# EAGLE design Wedding_Centerpiece_Controller_V1.1 (EAGLE 6.4)
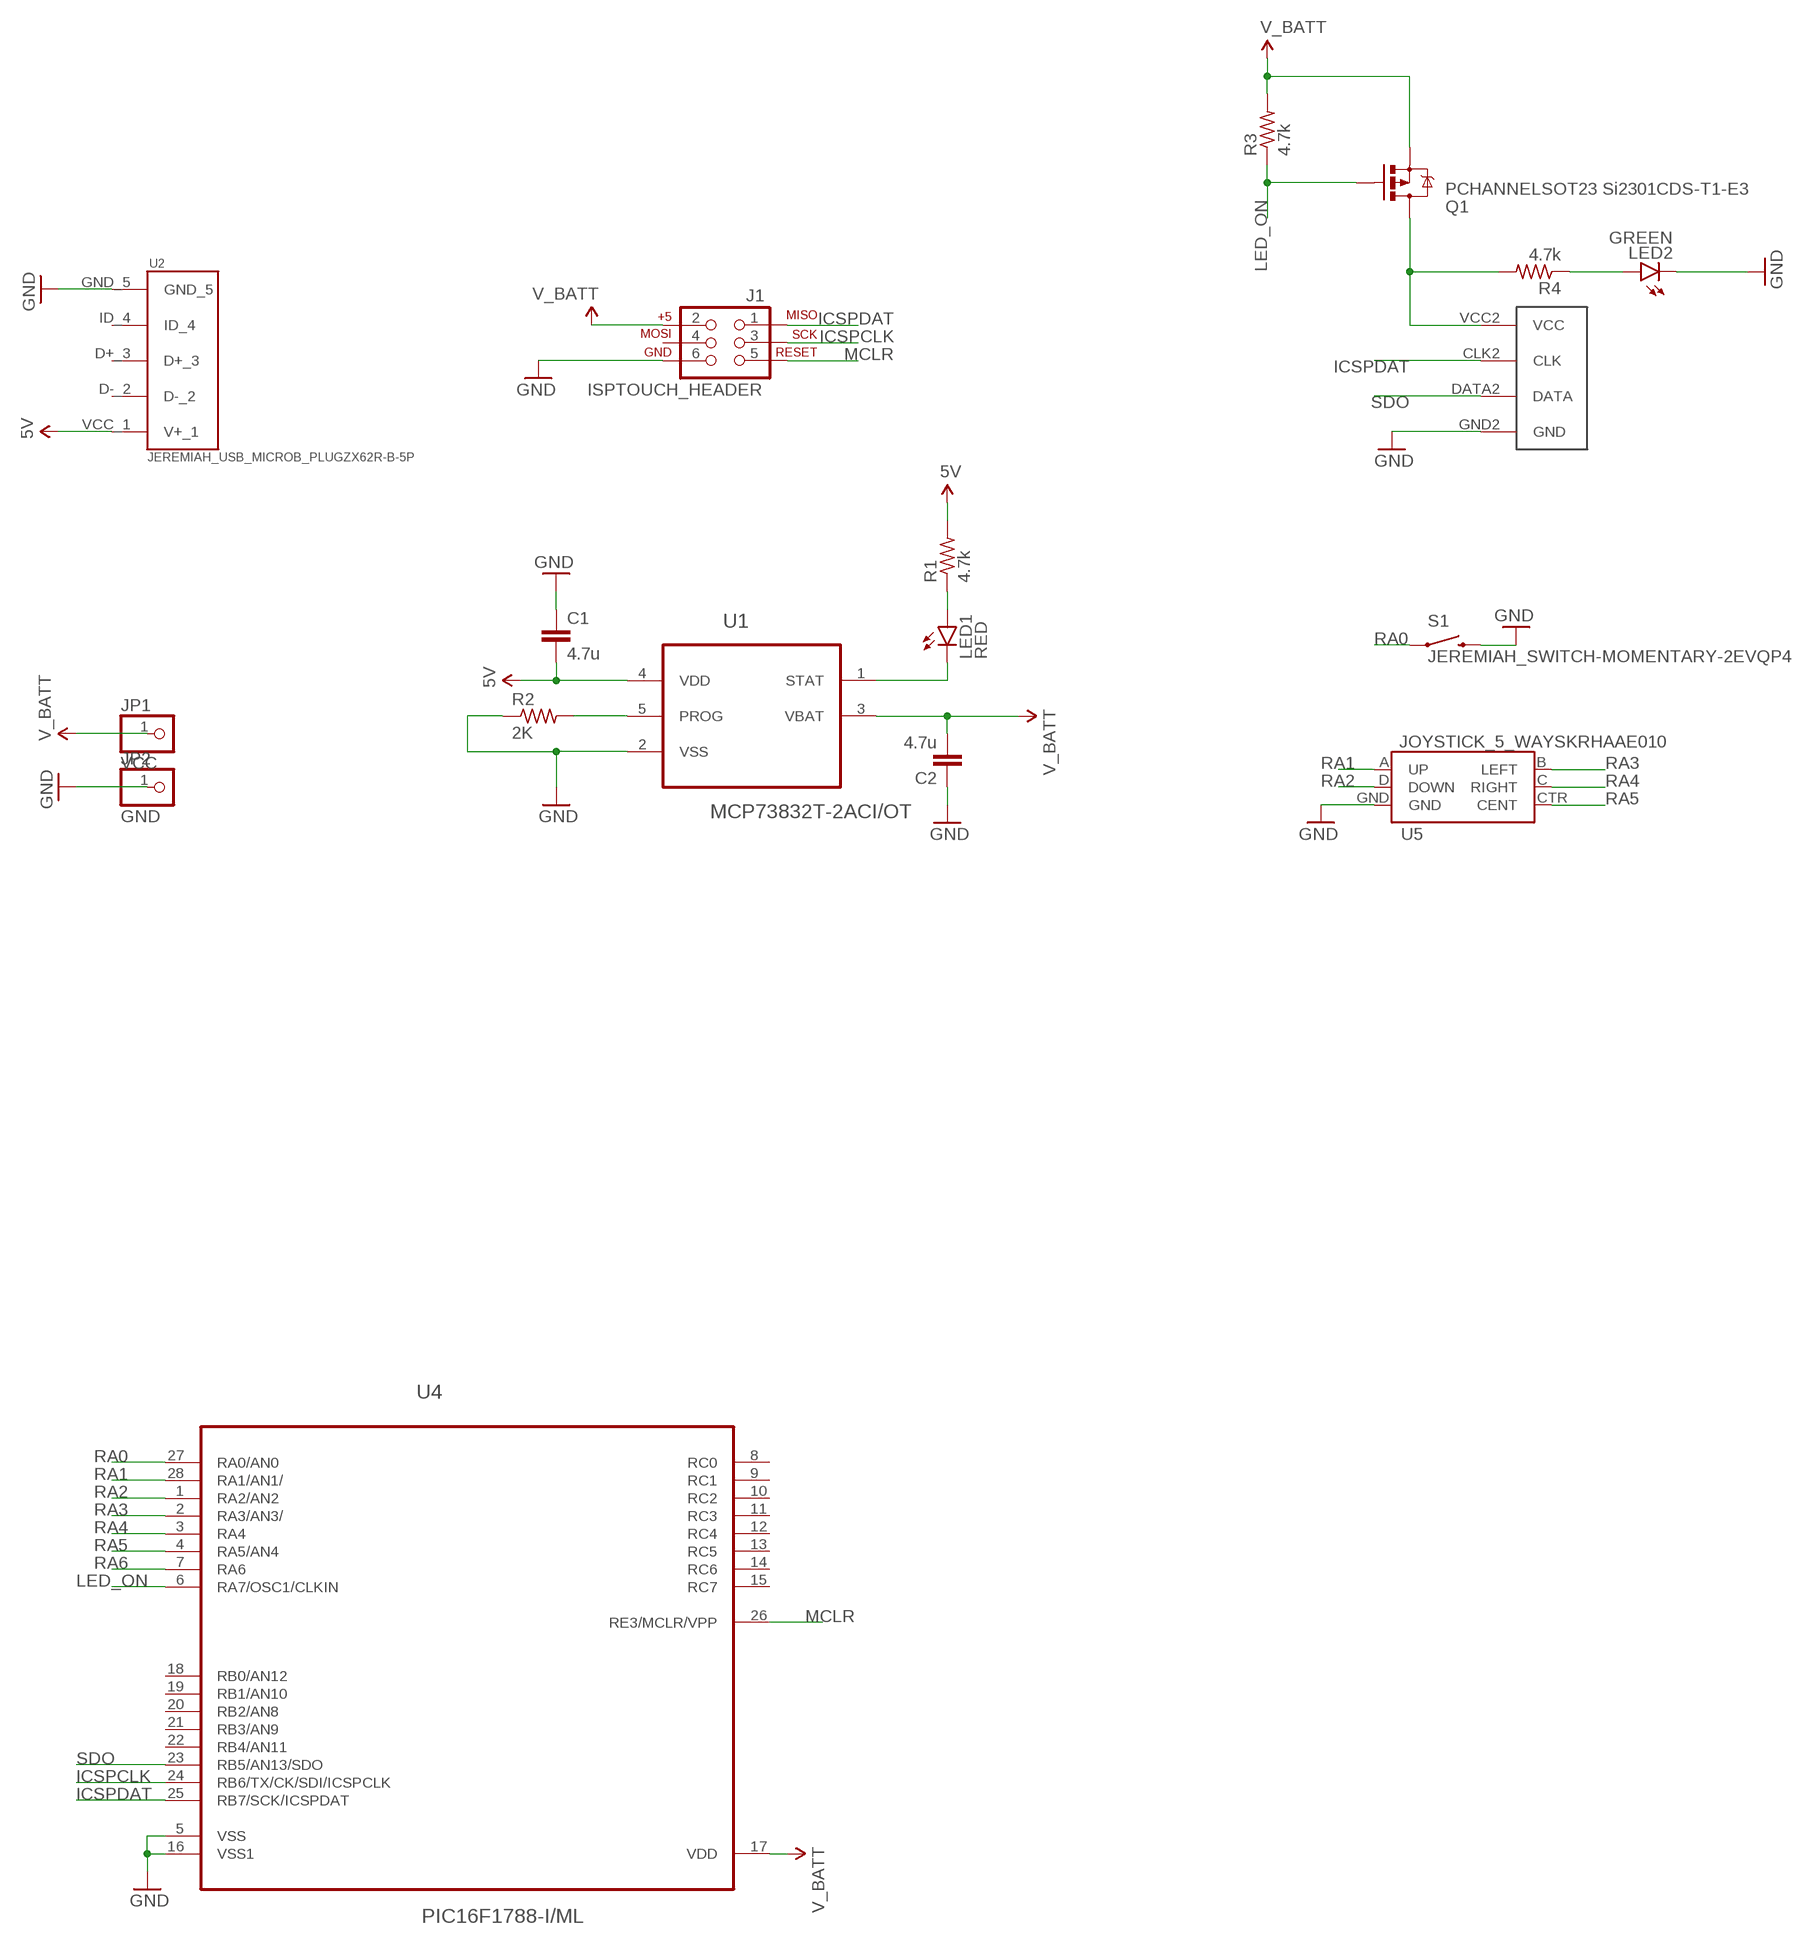
[diagram p0: schematic, sheet 1]

## Parts
C1  4.7u  CAP0402-CAP  [0402-CAP]
C2  4.7u  CAP0402-CAP  [0402-CAP]
J1  ISPTOUCH_HEADER  [AVX_9188_6-WAY_MATING_GUIDE]
JP1  VCC  PINHD-1X1  [1X01]
JP2  GND  PINHD-1X1  [1X01]
LED1  RED  LED0603  [LED-0603]
LED2  GREEN  LED0603  [LED-0603]
Q1  PCHANNELSOT23 Si2301CDS-T1-E3  JEREMIAH_MOSFET-PCHANNELSOT23  [JEREMIAH_SOT23]
R1  4.7k  R-US_R0402  [R0402]
R2  2K  R-US_R0402  [R0402]
R3  4.7k  R-US_R0402  [R0402]
R4  4.7k  R-US_R0402  [R0402]
S1  JEREMIAH_SWITCH-MOMENTARY-2EVQP4  [JEREMIAH_EVQP4_SWITCH]
U1  MCP73832T-2ACI/OT  [SOT95P280X145-5N]
U2  JEREMIAH_USB_MICROB_PLUGZX62R-B-5P  [JEREMIAH_USB_MICRO_ZX62R-B-5P]
U3  JEREMIAH_LED_STRIP_WS2801CLENLED_2L_BEGIN  [JEREMIAH_LED_STRIP_WS2801_CLENLED_2L_BEGIN]
U4  PIC16F1788-I/ML  [QFN65P600X600X100-29N]
U5  JOYSTICK_5_WAYSKRHAAE010  [ALPS_SKRHAAE010]

## Nets
5V: C1.2 R1.2 U1.4(VDD) U2.VCC_1(V+_1)
GND: C1.1 C2.1 J1.6 JP2.1 LED2.C R2.1 S1.2 U1.2(VSS) U2.GND_5 U3.GND2(GND) U4.5(VSS) U4.16(VSS1) U5.GND
ICSPCLK: J1.3 U4.24(RB6/TX/CK/SDI/ICSPCLK)
ICSPDAT: J1.1 U3.CLK2(CLK) U4.25(RB7/SCK/ICSPDAT)
LED_ON: Q1.1(G) R3.1 U4.6(RA7/OSC1/CLKIN)
MCLR: J1.5 U4.26(RE3/MCLR/VPP)
N$1: R2.2 U1.5(PROG)
N$2: LED1.A R1.1
N$3: LED1.C U1.1(STAT)
N$5: Q1.3(D) R4.2 U3.VCC2(VCC)
N$6: LED2.A R4.1
RA0: S1.1 U4.27(RA0/AN0)
RA1: U4.28(RA1/AN1/) U5.A(UP)
RA2: U4.1(RA2/AN2) U5.D(DOWN)
RA3: U4.2(RA3/AN3/) U5.B(LEFT)
RA4: U4.3(RA4) U5.C(RIGHT)
RA5: U4.4(RA5/AN4) U5.CTR(CENT)
RA6: U4.7(RA6)
SDO: U3.DATA2(DATA) U4.23(RB5/AN13/SDO)
V_BATT: C2.2 J1.2 JP1.1 Q1.2(S) R3.2 U1.3(VBAT) U4.17(VDD)
Unconnected: J1.4 U2.D+_3 U2.D-_2 U2.ID_4 U4.8(RC0) U4.9(RC1) U4.10(RC2) U4.11(RC3) U4.12(RC4) U4.13(RC5) U4.14(RC6) U4.15(RC7) U4.18(RB0/AN12) U4.19(RB1/AN10) U4.20(RB2/AN8) U4.21(RB3/AN9) U4.22(RB4/AN11)

## Library data of the parts
C1 C2 = SparkFun-Passives:CAP: Capacitor Standard 0603 ceramic capacitor, and 0.1" leaded capacitor.
J1 = daspilker:ISPTOUCH: ISPtouch for AVR Microcontrollers This 6-pin ISP connector for AVR programming does not require any part on the PCB, but an adapter for a common 6-pin programmer. http://daniel-spilker.com/blog/2011/04/25/isptouch-for-avr-microcontrollers/
JP1 JP2 = pinhead:PINHD-1X1: PIN HEADER
LED1 LED2 = SparkFun-LED:LED: LEDs Standard schematic elements and footprints for 5mm, 3mm, 1206, and 0603 sized LEDs. 5mm - Spark Fun Electronics SKU : COM-00529 (and others)
Q1 = Phoenix_Hoop_94_PolyPro_AlwaysOn:JEREMIAH_MOSFET-PCHANNEL
R1-R4 = resistor:R-US_: RESISTOR, American symbol
S1 = Phoenix_Hoop_94_PolyPro_AlwaysOn:JEREMIAH_SWITCH-MOMENTARY-2
U1 = Microchip_By_element14_Batch_1:MCP73832T-2ACI/OT: Charge Management Controller; MPN: MCP73832T-2ACI/OT; OC_FARNELL: 1332159; OC_NEWARK: 88K5656; PACKAGE: SOT-5; SUPPLIER: Microchip
U2 = Phoenix_Hoop_94_PolyPro_AlwaysOn:JEREMIAH_USB_MICROB_PLUG
U3 = Phoenix_Hoop_94_PolyPro_AlwaysOn:JEREMIAH_LED_STRIP_WS2801
U4 = Microchip:PIC16F1788-I/ML
U5 = Switches:JOYSTICK_5_WAY

## Board
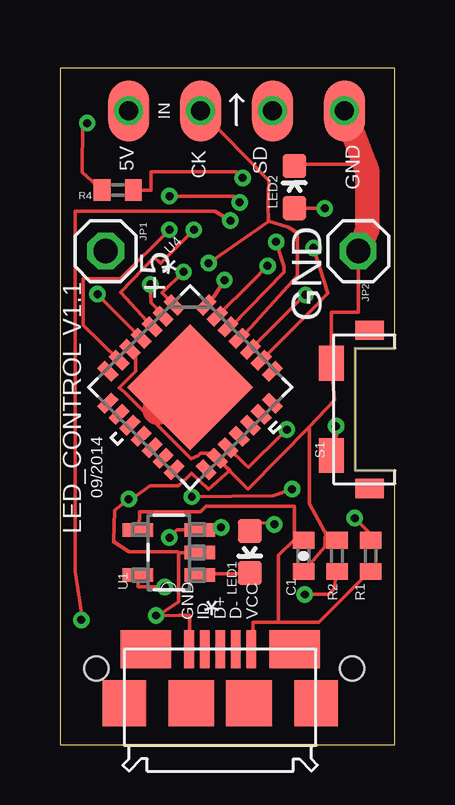
[diagram p1: board, top side]
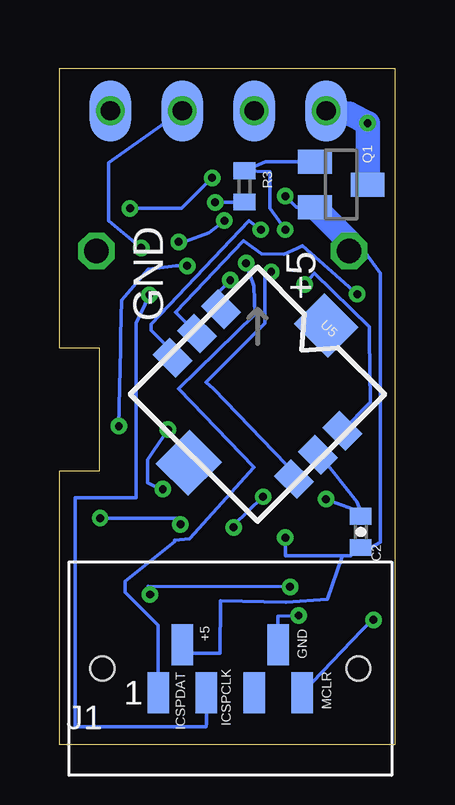
[diagram p2: board, bottom side, seen from below]

Size 13.97 x 28.19 mm. Coordinates in mm from the lower left corner, seen from the top.
Outline: 0,0 13.97,0 13.97,11.43 12.32,11.43 12.32,16.53 13.97,16.53 13.97,28.19 0,28.19 0,0
Copper layers (1*16): Top 0.0356mm / dielectric 1.5011mm / Bottom 0.0356mm
Design rules "OSH_Park_PCBOrder": minimum track width 6mil, minimum drill 13mil, track to track 6mil, track to pad 6mil, pad to pad 6mil, via to via 6mil, smd to smd 6mil, copper to edge 15mil, drill to drill 6mil, minimum pad ring 7mil, minimum via ring 7mil, stop-mask expansion 3mil, vias tented up to drill 13mil, thermal gap 10mil

### Footprints (pad centres in the part's own frame; a part is rotated, then mirrored left to right if it is on the bottom)
0402-CAP = smd 0.7 x 0.9: 1 -0.65,0; 2 0.65,0
AVX_9188_6-WAY_MATING_GUIDE = smd 0.9 x 1.7: 1 -3,-1; 2 -2,1; 3 -1,-1; 4 1,-1; 5 3,-1; 6 2,1 | hole 1: -5.334,0; 5.334,0
1X01 = drill 1.016 octagon: 1 0,0
LED-0603 = smd 1 x 1: A 0,-0.877; C 0,0.877
JEREMIAH_SOT23 = smd 1 x 1.4: 1 -0.95,-1.1; 2 0.95,-1.1; 3 0,1.1
R0402 = smd 0.7 x 0.9: 1 -0.65,0; 2 0.65,0
JEREMIAH_EVQP4_SWITCH = smd 1.45 x 1.05: 1 -1.925,2.65; 2 1.925,2.65 | smd 0.8 x 1.2: NC_1 -3.3,1.05; NC_2 3.3,1.05
SOT95P280X145-5N = smd 1.27 x 0.559: 1 -1.295,0.94; 2 -1.295,0; 3 -1.295,-0.94; 4 1.295,-0.94; 5 1.295,0.94
JEREMIAH_USB_MICRO_ZX62R-B-5P = smd 0.4 x 1.6: D+_3 0,0; D-_2 0.65,0; GND_5 -1.3,0; ID_4 -0.65,0; VCC_1 1.3,0 | smd 2.1 x 1.6: P$6 -3.1,0; P$7 3.1,0 | smd 1.9 x 1.9: P$8 -1.2,-2.25; P$9 1.2,-2.25 | smd 1.8 x 1.9: P$10 -4,-2.25; P$11 4,-2.25
JEREMIAH_LED_STRIP_WS2801_CLENLED_2L_BEGIN = smd 2.54 x 1.7: CLK 0,1.5; DATA 0,-1.5; GND 0,-4.5; VCC 0,4.5 | smd 2.54 x 1.7 bottom: CLK1 0,1.5; DATA1 0,-1.5; GND1 0,-4.5; VCC1 0,4.5 | drill 0.8: CLK2 0,1.5; DATA2 0,-1.5; GND2 0,-4.5; VCC2 0,4.5
QFN65P600X600X100-29N = smd 0.813 x 0.432: 1 -2.896,1.956; 2 -2.896,1.295; 3 -2.896,0.66; 4 -2.896,0; 5 -2.896,-0.66; 6 -2.896,-1.295; 7 -2.896,-1.956; 15 2.896,-1.956; 16 2.896,-1.295; 17 2.896,-0.66; 18 2.896,0; 19 2.896,0.66; 20 2.896,1.295; 21 2.896,1.956 | smd 0.432 x 0.813: 8 -1.956,-2.896; 9 -1.295,-2.896; 10 -0.66,-2.896; 11 0,-2.896; 12 0.66,-2.896; 13 1.295,-2.896; 14 1.956,-2.896; 22 1.956,2.896; 23 1.295,2.896; 24 0.66,2.896; 25 0,2.896; 26 -0.66,2.896; 27 -1.295,2.896; 28 -1.956,2.896 | smd 3.708 x 3.708: 29 0,0
ALPS_SKRHAAE010 = smd 1.35 x 1: A -3.575,1.425; B 3.575,1.425; C -3.575,-1.425; CTR -3.575,0; D 3.575,-1.425; GND 3.575,0 | smd 2 x 1.8: NC 0,4.05 | smd 1.9 x 2: NC@0 0,-4.05

### Placement (x,y rotation side)
C1  10.16,7.87 90 top
C2  1.42,8.87 270 bottom
J1  6.86,3.17 0 bottom
JP1  1.91,20.57 0 top
JP2  12.45,20.57 0 top
LED1  7.92,8.04 180 top
LED2  9.78,23.24 0 top
Q1  2.24,23.34 270 bottom
R1  12.95,7.87 270 top
R2  11.56,7.87 270 top
R3  6.27,23.27 270 bottom
R4  2.41,23.11 180 top
S1  13.97,13.98 90 top
U1  4.54,8.02 180 top
U2  6.69,3.98 0 top
U3  7.37,26.42 90 top
U4  5.43,14.9 315 top
U5  5.73,14.61 315 bottom

### Tracks (layer width: path | path; a pad name or v marks a point on that pad's centre or on a via)
5V
  Top 0.152: U1.4 3.3,9.02 3.32,9.71 5.86,9.71 6.09,9.95 9.79,9.95 9.78,8.73 C1.2 9.75,8.53 9.12,7.9 9.12,5.11 | 9.12,5.11 8.05,5.11 8.05,4.06 U2.VCC_1 | 9.12,5.11 10.79,5.11 13.06,7.37 R1.2
GND  (via drill 0.33)
  Top 0.152: 10.41,13.24 11.45,14.37 S1.2 11.33,18.02 12.45,18.03 JP2.1 12.45,20.7 | 10.41,13.24 7.87,10.67 7.83,10.67 U4.16 | 4.95,8 5.82,8 U1.2 | 4.95,8 4.95,5.97 4.04,5.37 v4.01,5.39 4.97,5.4 5.41,5.4 5.41,4.06 U2.GND_5 | 4.95,8 4.9,8.05 2.9,8.05 2.23,8.46 2.29,9.78 v2.87,10.24 2.87,10.16 3.76,10.79 4.95,10.79 5.48,11.31 6.21,10.66 7.08,11.44 U4.16 | C1.1 10.57,7.7 11.05,8.26 11.05,8.64 11.43,8.64 R2.1 11.07,8.69 11.16,8.66 10.41,10.05 10.41,13.24 | U4.5 2.92,16.46 3.15,16.23 3.15,15.57 2.47,14.88 2.69,14.68 5.46,11.91 5.77,12.04 5.87,12.14 6.53,12.14 6.53,11.99 U4.16 | LED2.C 9.84,24.18 12.71,24.18
  Top 1.016: JP2.1 12.83,21.46 12.83,23.88 12.71,24.18 U3.GND2
  Bottom 0.152: v4.01,5.39 4.88,5.37 4.88,3.81 J1.6 | v2.87,10.24 1.5,9.73 C2.1 1.45,9.78 1.57,10.13 3.1,12.04 3.16,12.04 U5.GND
ICSPCLK  (via drill 0.33)
  Top 0.152: v10.24,18.75 9.84,18.37 U4.24
  Bottom 0.152: J1.3 7.86,0.87 7.87,0.76 13.34,0.76 13.34,10.29 10.79,10.29 10.79,17.56 v10.24,18.75
ICSPDAT  (via drill 0.33)
  Top 0.152: U4.25 7.55,16.95 9.9,19.55 9.91,21.34 9.53,21.57 8.71,21.82 | 8.71,21.82 v6.2,20.07 | 8.71,21.82 8.7,21.84 8.69,22.51 8.71,23.5 U3.CLK2
  Bottom 0.152: v6.2,20.07 5.87,19.1 5.84,17.93 9.02,14.83 5.87,11.56 8.57,8.6 9.2,8.52 9.2,8.46 11.25,6.81 11.25,6.35 9.88,4.98 9.88,1.8 J1.1
LED_ON  (via drill 0.33)
  Top 0.152: U4.6 0.96,17.47 0.96,19.43 2.54,19.43 v4.57,21.46
  Bottom 0.152: v4.57,21.46 5.21,22.35 5.21,23.88 6.31,23.92 R3.1 5.39,24.29 Q1.1
MCLR  (via drill 0.33)
  Top 0.152: U4.26 7.13,17.41 9.35,19.68 9.35,19.94 v9.02,20.95 | v0.89,5.21 0.89,5.59 0.64,7.24 0.64,22.23 6.48,22.23 v7.11,21.84
  Bottom 0.152: v7.11,21.84 7.75,21.34 8.76,20.95 v9.02,20.95 | J1.5 0.95,5.21 v0.89,5.21
N$1  (via drill 0.33)
  Top 0.152: v10.21,6.26 11.22,6.26 11.43,6.48 R2.2 11.43,7.34 | v4.37,6.58 3.25,6.58 3.25,7.06 U1.5
  Bottom 0.152: v4.37,6.58 10.29,6.6 10.29,6.26 v10.21,6.26
N$2  (via drill 0.33)
  Top 0.152: v12.29,9.45 13.06,8.69 R1.1 | v8.94,9.18 7.92,9.32 LED1.A
  Bottom 0.152: v12.29,9.45 9.07,9.45 v8.94,9.18
N$3
  Top 0.152: LED1.C 7.9,7.14 5.84,7.14 5.84,7.09 U1.1
N$4
  Top 1.27: 4.06,13.97 5.21,14.73
N$5  (via drill 0.33)
  Top 0.152: R4.2 0.93,23.86 0.94,25.91 v1.14,25.91
  Bottom 1.016: Q1.3 v1.14,25.91 1.9,26.29 U3.VCC2
N$6  (via drill 0.33)
  Top 0.152: R4.1 3.81,23.11 3.81,23.88 7.37,23.88 v7.62,23.62 | v11.05,22.35 11.29,22.36 LED2.A
  Bottom 0.152: v7.62,23.62 8.89,22.35 v11.05,22.35
RA0  (via drill 0.33)
  Top 0.152: S1.1 11.57,13.06 v11.51,13.28 | v8.66,19.96 8,19.3 U4.27
  Bottom 0.152: v11.51,13.28 11.43,16.51 11.43,17.04 11.41,18.52 10.29,19.81 9.12,19.96 v8.66,19.96
RA1  (via drill 0.33)
  Top 0.152: v6.87,19.36 6.41,18.66 U4.28
  Bottom 0.152: v6.87,19.36 7.76,18.47 7.4,18.12 | 7.29,18.01 7.4,18.12 | U5.A 7.25,18.12 7.4,18.12
RA2  (via drill 0.33)
  Top 0.152: v5.16,19.71 4.27,18.85 U4.1
  Bottom 0.152: v5.16,19.71 5.21,19.68 5.41,19.51 5.41,17.58 7.87,15.11 7.57,14.83 4.01,11.15 4.13,11.15 U5.D
RA3  (via drill 0.33)
  Top 0.152: v3.77,19.19 3.81,18.41 4.3,17.93 U4.2
  Bottom 0.152: U5.B 1.02,14.27 1.05,16.99 1.05,17.42 3.35,19.65 v3.77,19.19
RA4  (via drill 0.33)
  Top 0.152: U4.3 2.54,18.85 3.94,20.32 4.19,20.07 v5.59,21.46
  Bottom 0.152: v5.59,21.46 6.08,21.83 10.16,17.53 10.16,17.27 9.27,16.38 | 9.27,16.38 9.09,16.2 | U5.C 9.27,16.38
RA5  (via drill 0.33)
  Top 0.152: v1.57,18.78 1.79,18.54 U4.4
  Bottom 0.152: v1.57,18.78 3.85,20.8 4.06,20.7 4.64,20.44 5.56,20.46 6.31,21 9.14,18.03 9.1,18.03 9.1,17.98 U5.CTR
SDO  (via drill 0.33)
  Top 0.152: v10.58,20.71 11.17,18.82 10.47,18.09 8.41,16.03 U4.23
  Bottom 0.152: v10.58,20.71 11.94,21.83 11.94,24.25 U3.DATA2
V_BATT  (via drill 0.33)
  Top 0.152: v4.57,8.64 4.89,8.96 U1.3 6.54,8.83 v6.72,9.06 | v5.5,10.34 8.88,10.37 v9.67,10.65 v9.68,10.65 | v9.46,13.13 9.27,12.95 7.87,11.56 7.71,11.68 U4.17 | v7.49,22.61 7.24,22.86 v4.57,22.86
  Bottom 0.152: 2.21,7.87 1.84,7.87 C2.2 1.02,8.22 0.61,8.45 0.61,19.16 0.61,19.66 1.27,20.57 JP1.1 | 2.21,7.87 4.57,7.87 v4.57,8.64 | J1.2 8.84,3.81 7.29,3.81 7.26,5.99 4.55,5.94 2.82,6.07 2.21,7.82 2.21,7.87 | v6.72,9.06 6.73,9.14 v5.5,10.34 | v9.68,10.65 9.77,10.65 10.32,10.93 10.31,11.88 10.07,12.26 v9.46,13.13 | R3.2 6.28,22.61 v7.49,22.61 | v4.57,22.86 4.11,22.39 Q1.2
  Bottom 0.406: JP1.1 1.91,20.96
  Bottom 1.016: 1.91,20.96 Q1.2

### Text on the board
tNames: LED_CONTROL V1.1 | +5 | GND | 09/2014
bNames: +5 | GND | GND | +5 | MCLR | ICSPCLK | ICSPDAT